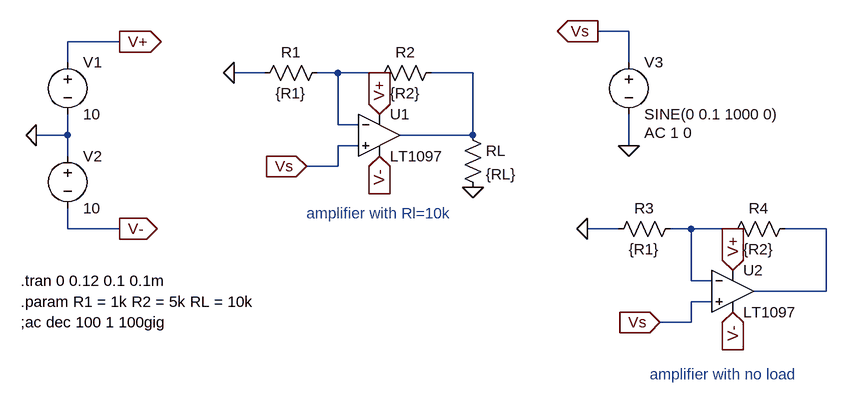
[diagram p0: schematic noninverting.asc]
noninverting.asc, the LTspice schematic file:
Version 4
SHEET 1 960 680
WIRE 576 0 528 0
WIRE -208 16 -288 16
WIRE -288 48 -288 16
WIRE 576 48 576 0
WIRE 16 64 -32 64
WIRE 128 64 96 64
WIRE 192 64 128 64
WIRE 336 64 272 64
WIRE 128 144 128 64
WIRE 160 144 128 144
WIRE -288 160 -288 128
WIRE -288 160 -336 160
WIRE 336 160 336 64
WIRE 336 160 224 160
WIRE 160 176 128 176
WIRE 576 176 576 128
WIRE -288 192 -288 160
WIRE 128 208 128 176
WIRE 128 208 80 208
WIRE -288 304 -288 272
WIRE -208 304 -288 304
WIRE 560 304 512 304
WIRE 672 304 640 304
WIRE 736 304 672 304
WIRE 880 304 816 304
WIRE 672 384 672 304
WIRE 704 384 672 384
WIRE 880 400 880 304
WIRE 880 400 768 400
WIRE 704 416 672 416
WIRE 672 448 672 416
WIRE 672 448 624 448
FLAG -32 64 0
FLAG -336 160 0
FLAG -208 16 V+
IOPIN -208 16 Out
FLAG -208 304 V-
IOPIN -208 304 Out
FLAG 192 128 V+
IOPIN 192 128 In
FLAG 192 192 V-
IOPIN 192 192 In
FLAG 576 176 0
FLAG 528 0 Vs
IOPIN 528 0 Out
FLAG 80 208 Vs
IOPIN 80 208 In
FLAG 336 240 0
FLAG 512 304 0
FLAG 736 368 V+
IOPIN 736 368 In
FLAG 736 432 V-
IOPIN 736 432 In
FLAG 624 448 Vs
IOPIN 624 448 In
SYMBOL OpAmps\\LT1097 192 96 R0
SYMATTR InstName U1
SYMBOL res 112 48 R90
WINDOW 0 0 56 VBottom 2
WINDOW 3 32 56 VTop 2
SYMATTR InstName R1
SYMATTR Value {R1}
SYMBOL res 288 48 R90
WINDOW 0 0 56 VBottom 2
WINDOW 3 32 56 VTop 2
SYMATTR InstName R2
SYMATTR Value {R2}
SYMBOL voltage -288 32 R0
SYMATTR InstName V1
SYMATTR Value 10
SYMBOL voltage -288 176 R0
SYMATTR InstName V2
SYMATTR Value 10
SYMBOL voltage 576 32 R0
WINDOW 123 24 124 Left 2
WINDOW 39 0 0 Left 0
SYMATTR Value2 AC 1 0
SYMATTR InstName V3
SYMATTR Value SINE(0 0.1 1000 0)
SYMBOL res 320 144 R0
SYMATTR InstName RL
SYMATTR Value {RL}
SYMBOL OpAmps\\LT1097 736 336 R0
SYMATTR InstName U2
SYMBOL res 656 288 R90
WINDOW 0 0 56 VBottom 2
WINDOW 3 32 56 VTop 2
SYMATTR InstName R3
SYMATTR Value {R1}
SYMBOL res 832 288 R90
WINDOW 0 0 56 VBottom 2
WINDOW 3 32 56 VTop 2
SYMATTR InstName R4
SYMATTR Value {R2}
TEXT -360 384 Left 2 !.tran 0 0.12 0.1 0.1m
TEXT -360 416 Left 2 !.param R1 = 1k R2 = 5k RL = 10k
TEXT -360 448 Left 2 !;ac dec 100 1 100gig
TEXT 608 528 Left 2 ;amplifier with no load
TEXT 80 280 Left 2 ;amplifier with Rl=10k

The netlist it stands for:
* noninverting.asc
XU1 Vs N001 V+ V- N002 LT1097  ; pins In+ In- V+ V- OUT
R1 N001 0 {R1}
R2 N002 N001 {R2}
V1 V+ 0 10
V2 0 V- 10
V3 Vs 0 SINE(0 0.1 1000 0) AC 1 0
RL N002 0 {RL}
XU2 Vs N003 V+ V- N004 LT1097  ; pins In+ In- V+ V- OUT
R3 N003 0 {R1}
R4 N004 N003 {R2}
.tran 0 0.12 0.1 0.1m
.param R1 = 1k R2 = 5k RL = 10k
;ac dec 100 1 100gig
* amplifier with no load
* amplifier with Rl=10k
.backanno
.end